# Altium schematic sheet PCB_Segment_Shift_Reg.SchDoc
size A
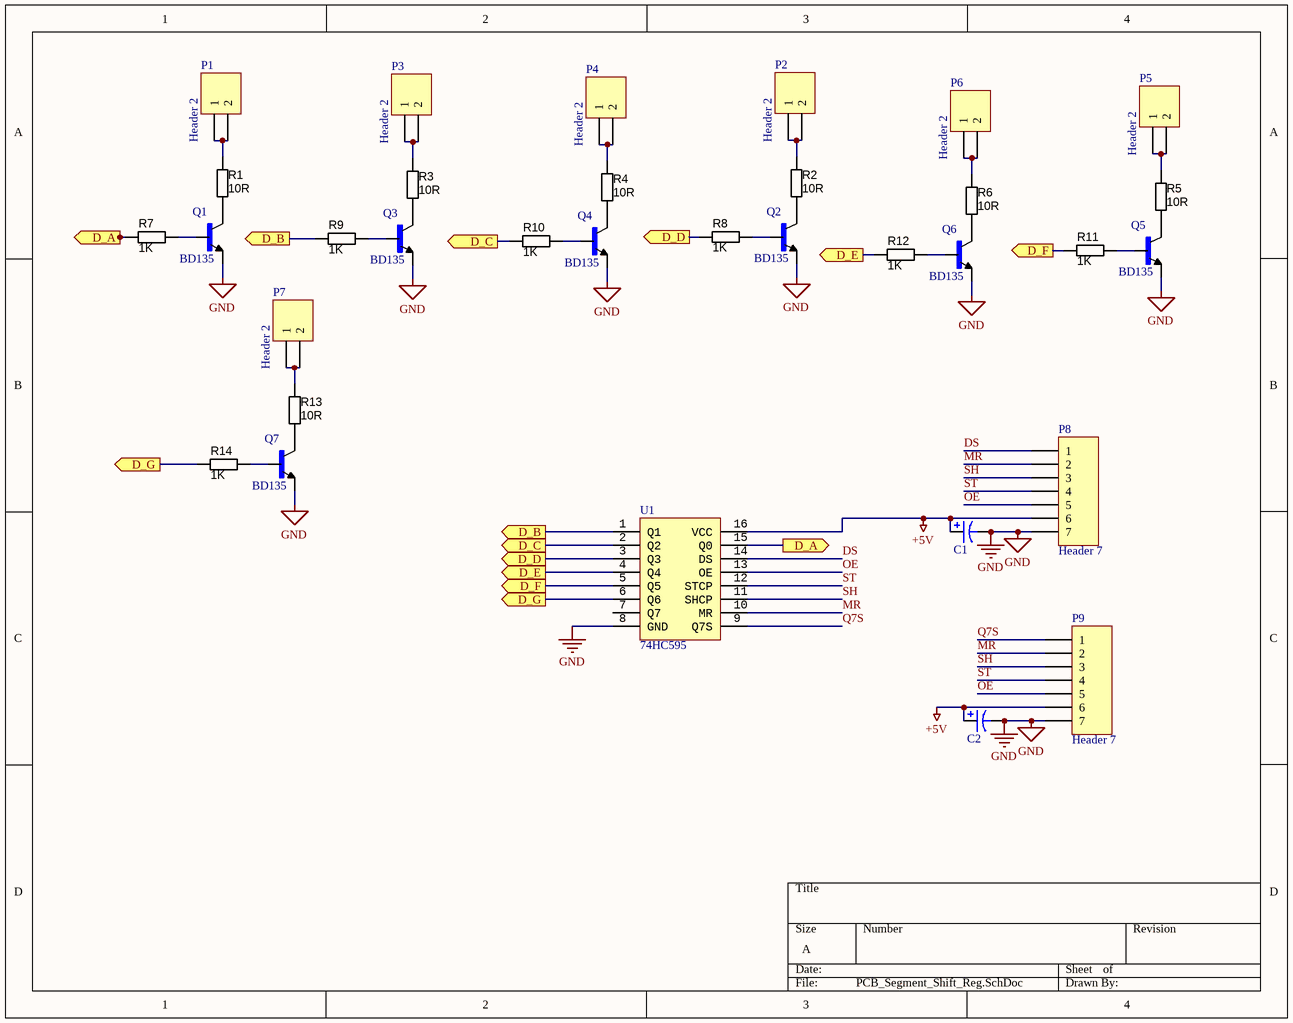
[diagram p0: PCB_Segment_Shift_Reg.SchDoc]

## Parts
C1  100 μF  [CAPE10.0MM_Rad_10x14mm]  (value not drawn)
C2  100 μF  [CAPE10.0MM_Rad_10x14mm]  (value not drawn)
P1  Header 2  [HDR1X2]
P2  Header 2  [HDR1X2]
P3  Header 2  [HDR1X2]
P4  Header 2  [HDR1X2]
P5  Header 2  [HDR1X2]
P6  Header 2  [HDR1X2]
P7  Header 2  [HDR1X2]
P8  Header 7  [HDR1X7]
P9  Header 7  [HDR1X7]
Q1  BD135  [*TO229P780X300X2000-3 - duplicate]
Q2  BD135  [*TO229P780X300X2000-3 - duplicate]
Q3  BD135  [*TO229P780X300X2000-3 - duplicate]
Q4  BD135  [*TO229P780X300X2000-3 - duplicate]
Q5  BD135  [*TO229P780X300X2000-3 - duplicate]
Q6  BD135  [*TO229P780X300X2000-3 - duplicate]
Q7  BD135  [*TO229P780X300X2000-3 - duplicate]
R1  value 10R  [AXIAL-0.6]  (hidden comment: Metal Film)
R2  value 10R  [AXIAL-0.6]  (hidden comment: Metal Film)
R3  value 10R  [AXIAL-0.6]  (hidden comment: Metal Film)
R4  value 10R  [AXIAL-0.6]  (hidden comment: Metal Film)
R5  value 10R  [AXIAL-0.6]  (hidden comment: Metal Film)
R6  value 10R  [AXIAL-0.6]  (hidden comment: Metal Film)
R7  value 1K  [RESTH_AXIAL-0.4]  (hidden comment: Carbon Film)
R8  value 1K  [RESTH_AXIAL-0.4]  (hidden comment: Carbon Film)
R9  value 1K  [RESTH_AXIAL-0.4]  (hidden comment: Carbon Film)
R10  value 1K  [RESTH_AXIAL-0.4]  (hidden comment: Carbon Film)
R11  value 1K  [RESTH_AXIAL-0.4]  (hidden comment: Carbon Film)
R12  value 1K  [RESTH_AXIAL-0.4]  (hidden comment: Carbon Film)
R13  value 10R  [AXIAL-0.6]  (hidden comment: Metal Film)
R14  value 1K  [RESTH_AXIAL-0.4]  (hidden comment: Carbon Film)
U1  74HC595  [DIP_300_16]

## Ports
D_A (out), D_B (out), D_C (out), D_D (out), D_E (out), D_F (out), D_G (out)

## Nets
+5V: C1.1 C2.1 P8.6 P9.6 U1.16(VCC)
GND: C1.2 C2.2 P8.7 P9.7 Q1.1(E) Q2.1(E) Q3.1(E) Q4.1(E) Q5.1(E) Q6.1(E) Q7.1(E) U1.8(GND)
D_A: R7.1 U1.15(Q0) ; port D_A
D_B: R9.1 U1.1(Q1) ; port D_B
D_C: R10.1 U1.2(Q2) ; port D_C
D_D: R8.1 U1.3(Q3) ; port D_D
D_E: R12.1 U1.4(Q4) ; port D_E
D_F: R11.1 U1.5(Q5) ; port D_F
D_G: R14.1 U1.6(Q6) ; port D_G
DS: P8.1 U1.14(DS)
MR: P8.2 P9.2 U1.10(MR)
OE: P8.5 P9.5 U1.13(OE)
Q7S: P9.1 U1.9(Q7S)
SH: P8.3 P9.3 U1.11(SHCP)
ST: P8.4 P9.4 U1.12(STCP)
NetP1_1: P1.1 P1.2 R1.1
NetP2_1: P2.1 P2.2 R2.1
NetP3_1: P3.1 P3.2 R3.1
NetP4_1: P4.1 P4.2 R4.1
NetP5_1: P5.1 P5.2 R5.1
NetP6_1: P6.1 P6.2 R6.1
NetP7_1: P7.1 P7.2 R13.1
NetQ1_2: Q1.2(C) R1.2
NetQ1_3: Q1.3(B) R7.2
NetQ2_2: Q2.2(C) R2.2
NetQ2_3: Q2.3(B) R8.2
NetQ3_2: Q3.2(C) R3.2
NetQ3_3: Q3.3(B) R9.2
NetQ4_2: Q4.2(C) R4.2
NetQ4_3: Q4.3(B) R10.2
NetQ5_2: Q5.2(C) R5.2
NetQ5_3: Q5.3(B) R11.2
NetQ6_2: Q6.2(C) R6.2
NetQ6_3: Q6.3(B) R12.2
NetQ7_2: Q7.2(C) R13.2
NetQ7_3: Q7.3(B) R14.2

Not connected (* = marked no-connect by the designer): U1 7(Q7)

## Library data of the parts
C1 C2 = Electrolitic Capacitor, Thru-Hole: Contact: cynetik_group@hotmail.com; Published: 28 April 2014; Publisher: Cynetik Group; Created by: Zion Blue; Value: 100 μF
P1-P7 = Header 2: Header, 2-Pin; LatestRevisionDate: 17-Jul-2002; LatestRevisionNote: Re-released for DXP Platform.; Publisher: Altium Limited
P8 P9 = Header 7: Header, 7-Pin; LatestRevisionDate: 17-Jul-2002; LatestRevisionNote: Re-released for DXP Platform.; Publisher: Altium Limited
Q1-Q7 = BD135: Trans GP BJT NPN 45V 1.5A 3-Pin TO-126; MF: ON Semiconductor; SnapEDA_Link: https://www.snapeda.com/parts/BD135/ON%20Semiconductor/view-part/?ref=snap; Price: None; MP: BD135; Availability: Unavailable; Package: TO-126-3 NXP Semiconductors; Value: *
R1-R6 R13 = RES_10R_Axial_1W_5%: Resistor THD 10 Ohm 1W 5% Metal Film; Manufacturer 1: Vishay/BC Components; Manufacturer Part Number 1: PR01000101009JR500; SCDType: spec; Tolerance: ±5%; Package / Case: 2.5x8.0mm DxL; Ratings: 1W; Supplier 1: Digi-Key; Supplier Part Number 1: PPC10W-1CT-ND
R7-R12 R14 = RES_1K_Axial_0.25W_5%: Resistor THD Axial 1k Ohm 0.25W 5% Carbon Film; Manufacturer 1: Yageo; Manufacturer Part Number 1: CFR-25JB-1K0; Ratings: 1/4W; SCDType: spec; Tolerance: ±5%; Package / Case: Axial; Supplier 1: Digi-Key; Supplier Part Number 1: 1.0KQBK-ND
U1 = 74HC595: 74 Series